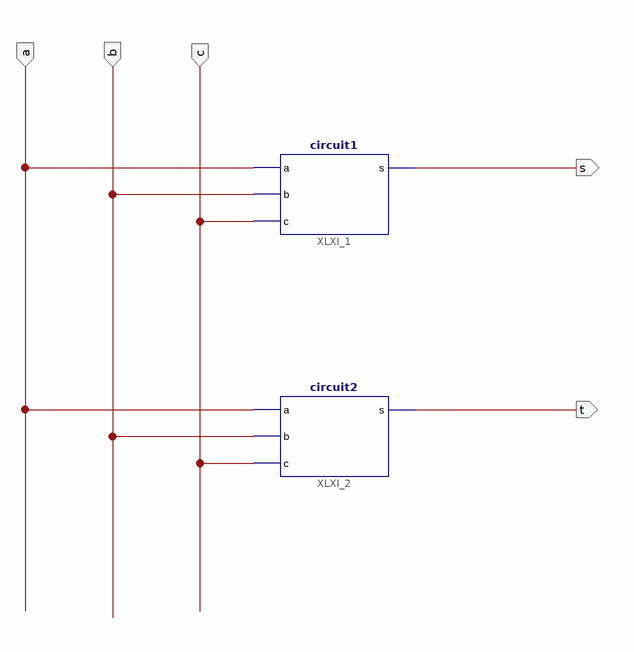
[diagram p0: schematic sheet 1]
// Xilinx ISE schematic toplevel.sch (spartan3e) as structural Verilog: 2 symbols, 5 ports
module toplevel (
  input  a,
  input  b,
  input  c,
  output s,
  output t
);

  circuit1 XLXI_1 (.a(a), .b(b), .c(c), .s(s));
  circuit2 XLXI_2 (.a(a), .b(b), .c(c), .s(t));
endmodule
